# Altium schematic sheet Sheet1.SchDoc
size A3
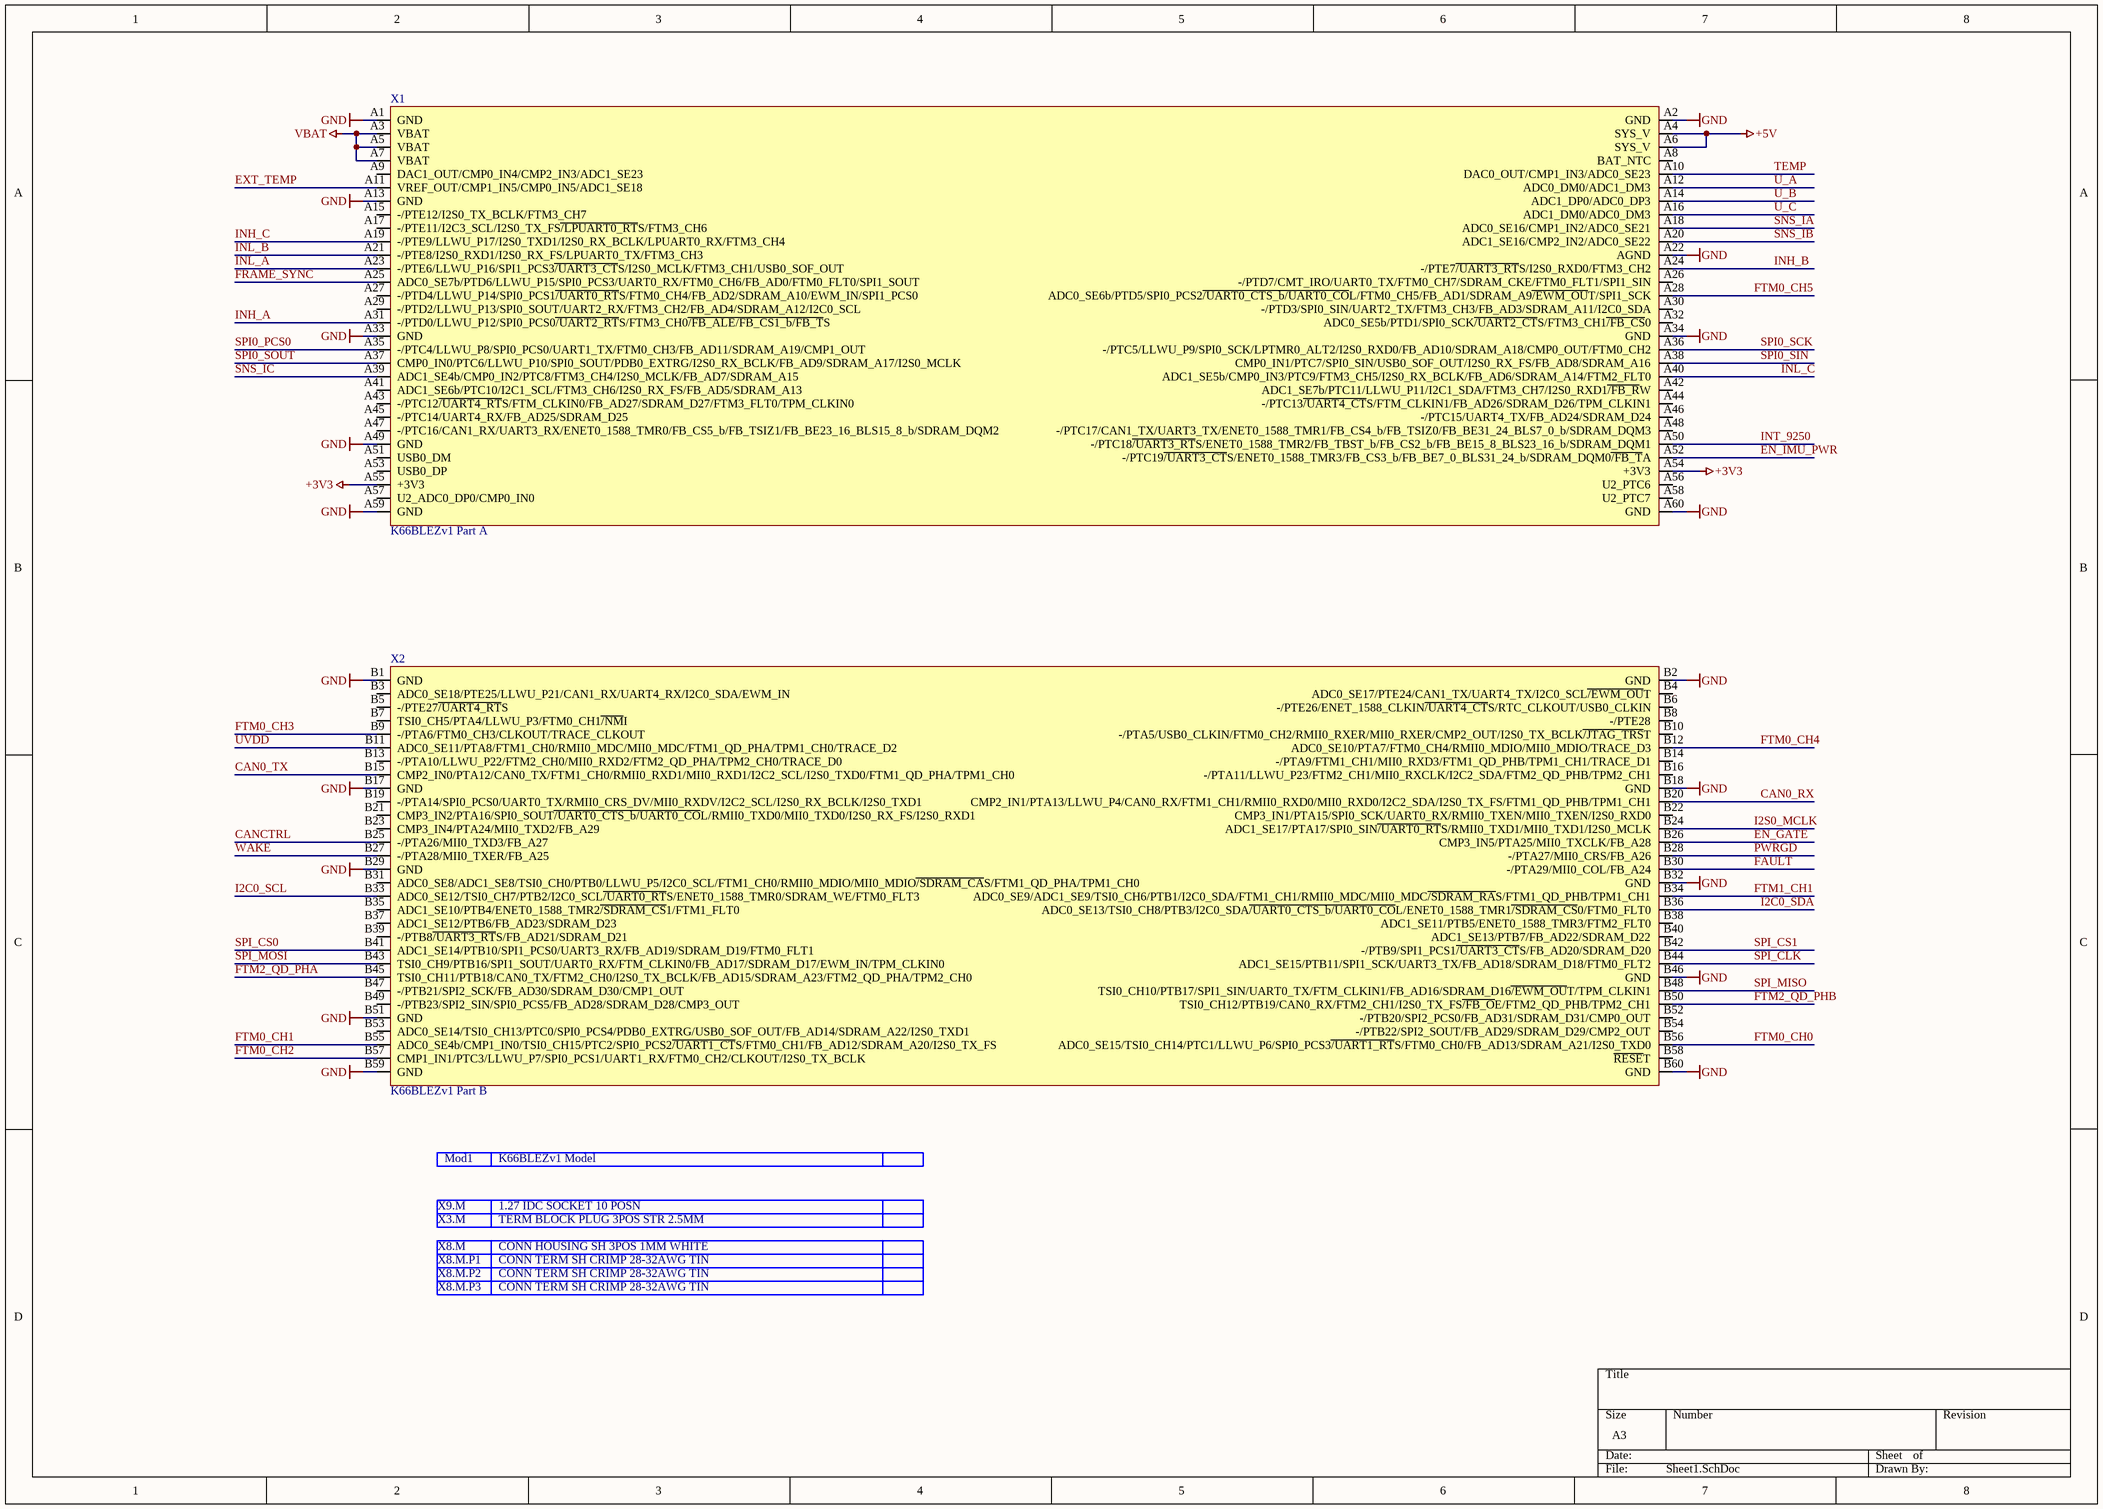
[diagram p0: Sheet1.SchDoc]

## Parts
Mod1  K66BLEZv1 Model  [K66BLEZv1.0 Mechanical]  (no BOM)
X1  K66BLEZv1 Part A  [K66BLEZv1.0 Part A]
X2  K66BLEZv1 Part B  [K66BLEZv1.0 Part B]
X3.M  TERM BLOCK PLUG 3POS STR 2.5MM
X8.M  CONN HOUSING SH 3POS 1MM WHITE
X8.M.P1  CONN TERM SH CRIMP 28-32AWG TIN
X8.M.P2  CONN TERM SH CRIMP 28-32AWG TIN
X8.M.P3  CONN TERM SH CRIMP 28-32AWG TIN
X9.M  1.27 IDC SOCKET 10 POSN

## Nets
+3V3: X1.A54(+3V3) X1.A55(+3V3)
+5V: X1.A4(SYS_V) X1.A6(SYS_V)
GND: X1.A1(GND) X1.A2(GND) X1.A13(GND) X1.A22(AGND) X1.A33(GND) X1.A34(GND) X1.A49(GND) X1.A59(GND) X1.A60(GND) X2.B1(GND) X2.B2(GND) X2.B17(GND) X2.B18(GND) X2.B29(GND) X2.B32(GND) X2.B46(GND) X2.B51(GND) X2.B59(GND) X2.B60(GND)
VBAT: X1.A3(VBAT) X1.A5(VBAT) X1.A7(VBAT)
CAN0_RX: X2.B20(CMP2_IN1/PTA13/LLWU_P4/CAN0_RX/FTM1_CH1/RMII0_RXD0/MII0_RXD0/I2C2_SDA/I2S0_TX_FS/FTM1_QD_PHB/TPM1_CH1)
CAN0_TX: X2.B15(CMP2_IN0/PTA12/CAN0_TX/FTM1_CH0/RMII0_RXD1/MII0_RXD1/I2C2_SCL/I2S0_TXD0/FTM1_QD_PHA/TPM1_CH0)
CANCTRL: X2.B25(-/PTA26/MII0_TXD3/FB_A27)
EN_GATE: X2.B26(CMP3_IN5/PTA25/MII0_TXCLK/FB_A28)
EN_IMU_PWR: X1.A52(-/PTC19~{/UART3_CT}S/ENET0_1588_TMR3/FB_CS3_b/FB_BE7_0_BLS31_24_b/SDRAM_DQM0~{/FB_T}A)
EXT_TEMP: X1.A11(VREF_OUT/CMP1_IN5/CMP0_IN5/ADC1_SE18)
FAULT: X2.B30(-/PTA29/MII0_COL/FB_A24)
FRAME_SYNC: X1.A25(ADC0_SE7b/PTD6/LLWU_P15/SPI0_PCS3/UART0_RX/FTM0_CH6/FB_AD0/FTM0_FLT0/SPI1_SOUT)
FTM0_CH0: X2.B56(ADC0_SE15/TSI0_CH14/PTC1/LLWU_P6/SPI0_PCS3~{/UART1_RT}S/FTM0_CH0/FB_AD13/SDRAM_A21/I2S0_TXD0)
FTM0_CH1: X2.B55(ADC0_SE4b/CMP1_IN0/TSI0_CH15/PTC2/SPI0_PCS2~{/UART1_CT}S/FTM0_CH1/FB_AD12/SDRAM_A20/I2S0_TX_FS)
FTM0_CH2: X2.B57(CMP1_IN1/PTC3/LLWU_P7/SPI0_PCS1/UART1_RX/FTM0_CH2/CLKOUT/I2S0_TX_BCLK)
FTM0_CH3: X2.B9(-/PTA6/FTM0_CH3/CLKOUT/TRACE_CLKOUT)
FTM0_CH4: X2.B12(ADC0_SE10/PTA7/FTM0_CH4/RMII0_MDIO/MII0_MDIO/TRACE_D3)
FTM0_CH5: X1.A28(ADC0_SE6b/PTD5/SPI0_PCS2~{/UART0_CTS_b/UART0_CO}L/FTM0_CH5/FB_AD1/SDRAM_A9~{/EWM_OU}T/SPI1_SCK)
FTM1_CH1: X2.B34(ADC0_SE9/ADC1_SE9/TSI0_CH6/PTB1/I2C0_SDA/FTM1_CH1/RMII0_MDC/MII0_MDC~{/SDRAM_RA}S/FTM1_QD_PHB/TPM1_CH1)
FTM2_QD_PHA: X2.B45(TSI0_CH11/PTB18/CAN0_TX/FTM2_CH0/I2S0_TX_BCLK/FB_AD15/SDRAM_A23/FTM2_QD_PHA/TPM2_CH0)
FTM2_QD_PHB: X2.B50(TSI0_CH12/PTB19/CAN0_RX/FTM2_CH1/I2S0_TX_FS~{/FB_O}E/FTM2_QD_PHB/TPM2_CH1)
I2C0_SCL: X2.B33(ADC0_SE12/TSI0_CH7/PTB2/I2C0_SCL~{/UART0_RT}S/ENET0_1588_TMR0/SDRAM_WE/FTM0_FLT3)
I2C0_SDA: X2.B36(ADC0_SE13/TSI0_CH8/PTB3/I2C0_SDA~{/UART0_CTS_b/UART0_CO}L/ENET0_1588_TMR1~{/SDRAM_CS}0/FTM0_FLT0)
I2S0_MCLK: X2.B24(ADC1_SE17/PTA17/SPI0_SIN~{/UART0_RT}S/RMII0_TXD1/MII0_TXD1/I2S0_MCLK)
INH_A: X1.A31(-/PTD0/LLWU_P12/SPI0_PCS0~{/UART2_RT}S/FTM3_CH0~{/FB_ALE/FB_CS1_b/FB_T}S)
INH_B: X1.A24(-/PTE7~{/UART3_RT}S/I2S0_RXD0/FTM3_CH2)
INH_C: X1.A19(-/PTE9/LLWU_P17/I2S0_TXD1/I2S0_RX_BCLK/LPUART0_RX/FTM3_CH4)
INL_A: X1.A23(-/PTE6/LLWU_P16/SPI1_PCS3~{/UART3_CT}S/I2S0_MCLK/FTM3_CH1/USB0_SOF_OUT)
INL_B: X1.A21(-/PTE8/I2S0_RXD1/I2S0_RX_FS/LPUART0_TX/FTM3_CH3)
INL_C: X1.A40(ADC1_SE5b/CMP0_IN3/PTC9/FTM3_CH5/I2S0_RX_BCLK/FB_AD6/SDRAM_A14/FTM2_FLT0)
INT_9250: X1.A50(-/PTC18~{/UART3_RT}S/ENET0_1588_TMR2/FB_TBST_b/FB_CS2_b/FB_BE15_8_BLS23_16_b/SDRAM_DQM1)
PWRGD: X2.B28(-/PTA27/MII0_CRS/FB_A26)
SNS_IA: X1.A18(ADC0_SE16/CMP1_IN2/ADC0_SE21)
SNS_IB: X1.A20(ADC1_SE16/CMP2_IN2/ADC0_SE22)
SNS_IC: X1.A39(ADC1_SE4b/CMP0_IN2/PTC8/FTM3_CH4/I2S0_MCLK/FB_AD7/SDRAM_A15)
SPI0_PCS0: X1.A35(-/PTC4/LLWU_P8/SPI0_PCS0/UART1_TX/FTM0_CH3/FB_AD11/SDRAM_A19/CMP1_OUT)
SPI0_SCK: X1.A36(-/PTC5/LLWU_P9/SPI0_SCK/LPTMR0_ALT2/I2S0_RXD0/FB_AD10/SDRAM_A18/CMP0_OUT/FTM0_CH2)
SPI0_SIN: X1.A38(CMP0_IN1/PTC7/SPI0_SIN/USB0_SOF_OUT/I2S0_RX_FS/FB_AD8/SDRAM_A16)
SPI0_SOUT: X1.A37(CMP0_IN0/PTC6/LLWU_P10/SPI0_SOUT/PDB0_EXTRG/I2S0_RX_BCLK/FB_AD9/SDRAM_A17/I2S0_MCLK)
SPI_CLK: X2.B44(ADC1_SE15/PTB11/SPI1_SCK/UART3_TX/FB_AD18/SDRAM_D18/FTM0_FLT2)
SPI_CS0: X2.B41(ADC1_SE14/PTB10/SPI1_PCS0/UART3_RX/FB_AD19/SDRAM_D19/FTM0_FLT1)
SPI_CS1: X2.B42(-/PTB9/SPI1_PCS1~{/UART3_CT}S/FB_AD20/SDRAM_D20)
SPI_MISO: X2.B48(TSI0_CH10/PTB17/SPI1_SIN/UART0_TX/FTM_CLKIN1/FB_AD16/SDRAM_D16~{/EWM_OU}T/TPM_CLKIN1)
SPI_MOSI: X2.B43(TSI0_CH9/PTB16/SPI1_SOUT/UART0_RX/FTM_CLKIN0/FB_AD17/SDRAM_D17/EWM_IN/TPM_CLKIN0)
TEMP: X1.A10(DAC0_OUT/CMP1_IN3/ADC0_SE23)
U_A: X1.A12(ADC0_DM0/ADC1_DM3)
U_B: X1.A14(ADC1_DP0/ADC0_DP3)
U_C: X1.A16(ADC1_DM0/ADC0_DM3)
UVDD: X2.B11(ADC0_SE11/PTA8/FTM1_CH0/RMII0_MDC/MII0_MDC/FTM1_QD_PHA/TPM1_CH0/TRACE_D2)
WAKE: X2.B27(-/PTA28/MII0_TXER/FB_A25)

Not connected (* = marked no-connect by the designer): Mod1 0; X1 A8(BAT_NTC) A9(DAC1_OUT/CMP0_IN4/CMP2_IN3/ADC1_SE23) A15(-/PTE12/I2S0_TX_BCLK/FTM3_CH7) A17(-/PTE11/I2C3_SCL/I2S0_TX_FS~{/LPUART0_RT}S/FTM3_CH6) A26(-/PTD7/CMT_IRO/UART0_TX/FTM0_CH7/SDRAM_CKE/FTM0_FLT1/SPI1_SIN) A27(-/PTD4/LLWU_P14/SPI0_PCS1~{/UART0_RT}S/FTM0_CH4/FB_AD2/SDRAM_A10/EWM_IN/SPI1_PCS0) A29(-/PTD2/LLWU_P13/SPI0_SOUT/UART2_RX/FTM3_CH2/FB_AD4/SDRAM_A12/I2C0_SCL) A30(-/PTD3/SPI0_SIN/UART2_TX/FTM3_CH3/FB_AD3/SDRAM_A11/I2C0_SDA) A32(ADC0_SE5b/PTD1/SPI0_SCK~{/UART2_CT}S/FTM3_CH1~{/FB_CS}0) A41(ADC1_SE6b/PTC10/I2C1_SCL/FTM3_CH6/I2S0_RX_FS/FB_AD5/SDRAM_A13) A42(ADC1_SE7b/PTC11/LLWU_P11/I2C1_SDA/FTM3_CH7/I2S0_RXD1~{/FB_R}W) A43(-/PTC12~{/UART4_RT}S/FTM_CLKIN0/FB_AD27/SDRAM_D27/FTM3_FLT0/TPM_CLKIN0) A44(-/PTC13~{/UART4_CT}S/FTM_CLKIN1/FB_AD26/SDRAM_D26/TPM_CLKIN1) A45(-/PTC14/UART4_RX/FB_AD25/SDRAM_D25) A46(-/PTC15/UART4_TX/FB_AD24/SDRAM_D24) A47(-/PTC16/CAN1_RX/UART3_RX/ENET0_1588_TMR0/FB_CS5_b/FB_TSIZ1/FB_BE23_16_BLS15_8_b/SDRAM_DQM2) A48(-/PTC17/CAN1_TX/UART3_TX/ENET0_1588_TMR1/FB_CS4_b/FB_TSIZ0/FB_BE31_24_BLS7_0_b/SDRAM_DQM3) A51(USB0_DM) A53(USB0_DP) A56(U2_PTC6) A57(U2_ADC0_DP0/CMP0_IN0) A58(U2_PTC7); X2 B3(ADC0_SE18/PTE25/LLWU_P21/CAN1_RX/UART4_RX/I2C0_SDA/EWM_IN) B4(ADC0_SE17/PTE24/CAN1_TX/UART4_TX/I2C0_SCL~{/EWM_OU}T) B5(-/PTE27~{/UART4_RT}S) B6(-/PTE26/ENET_1588_CLKIN~{/UART4_CT}S/RTC_CLKOUT/USB0_CLKIN) B7(TSI0_CH5/PTA4/LLWU_P3/FTM0_CH1~{/NM}I) B8(-/PTE28) B10(-/PTA5/USB0_CLKIN/FTM0_CH2/RMII0_RXER/MII0_RXER/CMP2_OUT/I2S0_TX_BCLK~{/JTAG_TRS}T) B13(-/PTA10/LLWU_P22/FTM2_CH0/MII0_RXD2/FTM2_QD_PHA/TPM2_CH0/TRACE_D0) B14(-/PTA9/FTM1_CH1/MII0_RXD3/FTM1_QD_PHB/TPM1_CH1/TRACE_D1) B16(-/PTA11/LLWU_P23/FTM2_CH1/MII0_RXCLK/I2C2_SDA/FTM2_QD_PHB/TPM2_CH1) B19(-/PTA14/SPI0_PCS0/UART0_TX/RMII0_CRS_DV/MII0_RXDV/I2C2_SCL/I2S0_RX_BCLK/I2S0_TXD1) B21(CMP3_IN2/PTA16/SPI0_SOUT~{/UART0_CTS_b/UART0_CO}L/RMII0_TXD0/MII0_TXD0/I2S0_RX_FS/I2S0_RXD1) B22(CMP3_IN1/PTA15/SPI0_SCK/UART0_RX/RMII0_TXEN/MII0_TXEN/I2S0_RXD0) B23(CMP3_IN4/PTA24/MII0_TXD2/FB_A29) B31(ADC0_SE8/ADC1_SE8/TSI0_CH0/PTB0/LLWU_P5/I2C0_SCL/FTM1_CH0/RMII0_MDIO/MII0_MDIO~{/SDRAM_CA}S/FTM1_QD_PHA/TPM1_CH0) B35(ADC1_SE10/PTB4/ENET0_1588_TMR2~{/SDRAM_CS}1/FTM1_FLT0) B37(ADC1_SE12/PTB6/FB_AD23/SDRAM_D23) B38(ADC1_SE11/PTB5/ENET0_1588_TMR3/FTM2_FLT0) B39(-/PTB8~{/UART3_RT}S/FB_AD21/SDRAM_D21) B40(ADC1_SE13/PTB7/FB_AD22/SDRAM_D22) B47(-/PTB21/SPI2_SCK/FB_AD30/SDRAM_D30/CMP1_OUT) B49(-/PTB23/SPI2_SIN/SPI0_PCS5/FB_AD28/SDRAM_D28/CMP3_OUT) B52(-/PTB20/SPI2_PCS0/FB_AD31/SDRAM_D31/CMP0_OUT) B53(ADC0_SE14/TSI0_CH13/PTC0/SPI0_PCS4/PDB0_EXTRG/USB0_SOF_OUT/FB_AD14/SDRAM_A22/I2S0_TXD1) B54(-/PTB22/SPI2_SOUT/FB_AD29/SDRAM_D29/CMP2_OUT) B58(~{RESE}T); X3.M 0; X8.M 0; X8.M.P1 0; X8.M.P2 0; X8.M.P3 0; X9.M 0

## Library data of the parts
X1 = K66BLEZv1 Part A: 60 Position Connector Header, Outer Shroud Contacts Surface Mount Gold; Manufacturer: Hirose Electric Co Ltd; PartName: FX6-60P-0.8SV(71); PartNum: H10787-ND; Distributor: Digi-Key
X2 = K66BLEZv1 Part B: 60 Position Connector Header, Outer Shroud Contacts Surface Mount Gold; Manufacturer: Hirose Electric Co Ltd; PartName: FX6-60P-0.8SV(71); PartNum: H10787-ND; Distributor: Digi-Key
X3.M = BOM item: 3 Position Terminal Block Plug, Female Sockets 0.098" (2.50mm) 180° Free Hanging (In-Line); Manufacturer: Phoenix Contact; PartName: 1709459; PartNum: 277-11811-ND; Distributor: Digi-Key
X8.M = BOM item: 3 Position Rectangular Housing Connector Receptacle Natural 0.039" (1.00mm); Manufacturer: JST Sales America Inc.; PartName: SHR-03V-S; PartNum: 455-1393-ND; Distributor: Digi-Key
X8.M.P1-X8.M.P3 = BOM item: Contact Crimp Socket 28-32 AWG Tin; Manufacturer: JST Sales America Inc.; PartName: SSH-003T-P0.2; PartNum: 455-1561-1-ND; Distributor: Digi-Key
X9.M = BOM item: 10 Position Rectangular Receptacle Connector IDC Gold 30 AWG; Manufacturer: CNC Tech; PartName: 3230-10-0101-00; PartNum: 1175-1645-ND; Distributor: Digi-Key